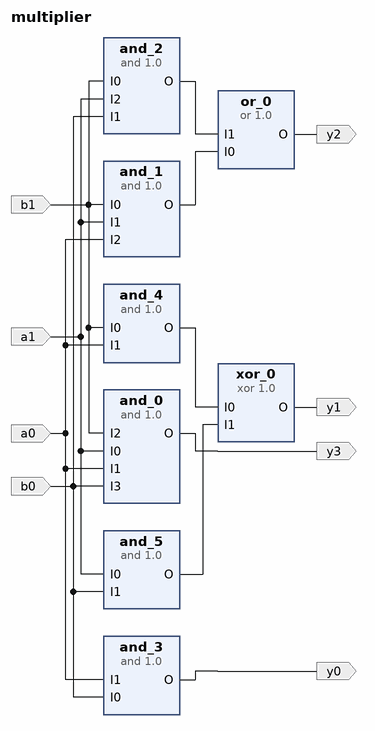
[diagram p0: block diagram of the top level]
# Vivado block design multiplier, xc7a200tfbg676-2, Vivado 2018.2
create_bd_design multiplier

create_bd_port -dir I -type data a1
create_bd_port -dir I -type data a0
create_bd_port -dir I -type data b1
create_bd_port -dir I -type data b0
create_bd_port -dir O -type data y3
create_bd_port -dir O -type data y2
create_bd_port -dir O -type data y1
create_bd_port -dir O -type data y0

create_bd_cell -type ip -vlnv FIT:user:and:1.0 and_0
set_property -dict {CONFIG.Inputs 4} [get_bd_cells and_0]
create_bd_cell -type ip -vlnv FIT:user:and:1.0 and_1
set_property -dict {CONFIG.Inputs 3 CONFIG.I2_inverted true} [get_bd_cells and_1]
create_bd_cell -type ip -vlnv FIT:user:and:1.0 and_2
set_property -dict {CONFIG.Inputs 3 CONFIG.I1_inverted true} [get_bd_cells and_2]
create_bd_cell -type ip -vlnv FIT:user:or:1.0 or_0
create_bd_cell -type ip -vlnv FIT:user:xor:1.0 xor_0
create_bd_cell -type ip -vlnv FIT:user:and:1.0 and_3
create_bd_cell -type ip -vlnv FIT:user:and:1.0 and_4
create_bd_cell -type ip -vlnv FIT:user:and:1.0 and_5

# ---- connections ----

connect_bd_net -net I0_0_1 [get_bd_ports a1] [get_bd_pins and_0/I0] [get_bd_pins and_5/I0] [get_bd_pins and_1/I1] [get_bd_pins and_2/I2]
connect_bd_net -net I1_0_1 [get_bd_ports a0] [get_bd_pins and_0/I1] [get_bd_pins and_4/I1] [get_bd_pins and_1/I2] [get_bd_pins and_3/I1]
connect_bd_net -net I2_0_1 [get_bd_ports b1] [get_bd_pins and_0/I2] [get_bd_pins and_4/I0] [get_bd_pins and_1/I0] [get_bd_pins and_2/I0]
connect_bd_net -net I3_0_1 [get_bd_ports b0] [get_bd_pins and_0/I3] [get_bd_pins and_5/I1] [get_bd_pins and_2/I1] [get_bd_pins and_3/I0]
connect_bd_net [get_bd_pins and_0/O] [get_bd_ports y3]
connect_bd_net [get_bd_pins and_1/O] [get_bd_pins or_0/I0]
connect_bd_net [get_bd_pins and_2/O] [get_bd_pins or_0/I1]
connect_bd_net [get_bd_pins or_0/O] [get_bd_ports y2]
connect_bd_net [get_bd_pins and_4/O] [get_bd_pins xor_0/I0]
connect_bd_net [get_bd_pins and_5/O] [get_bd_pins xor_0/I1]
connect_bd_net [get_bd_pins xor_0/O] [get_bd_ports y1]
connect_bd_net [get_bd_pins and_3/O] [get_bd_ports y0]

validate_bd_design
save_bd_design
